# EAGLE design MegaShield (EAGLE 9.2.0)
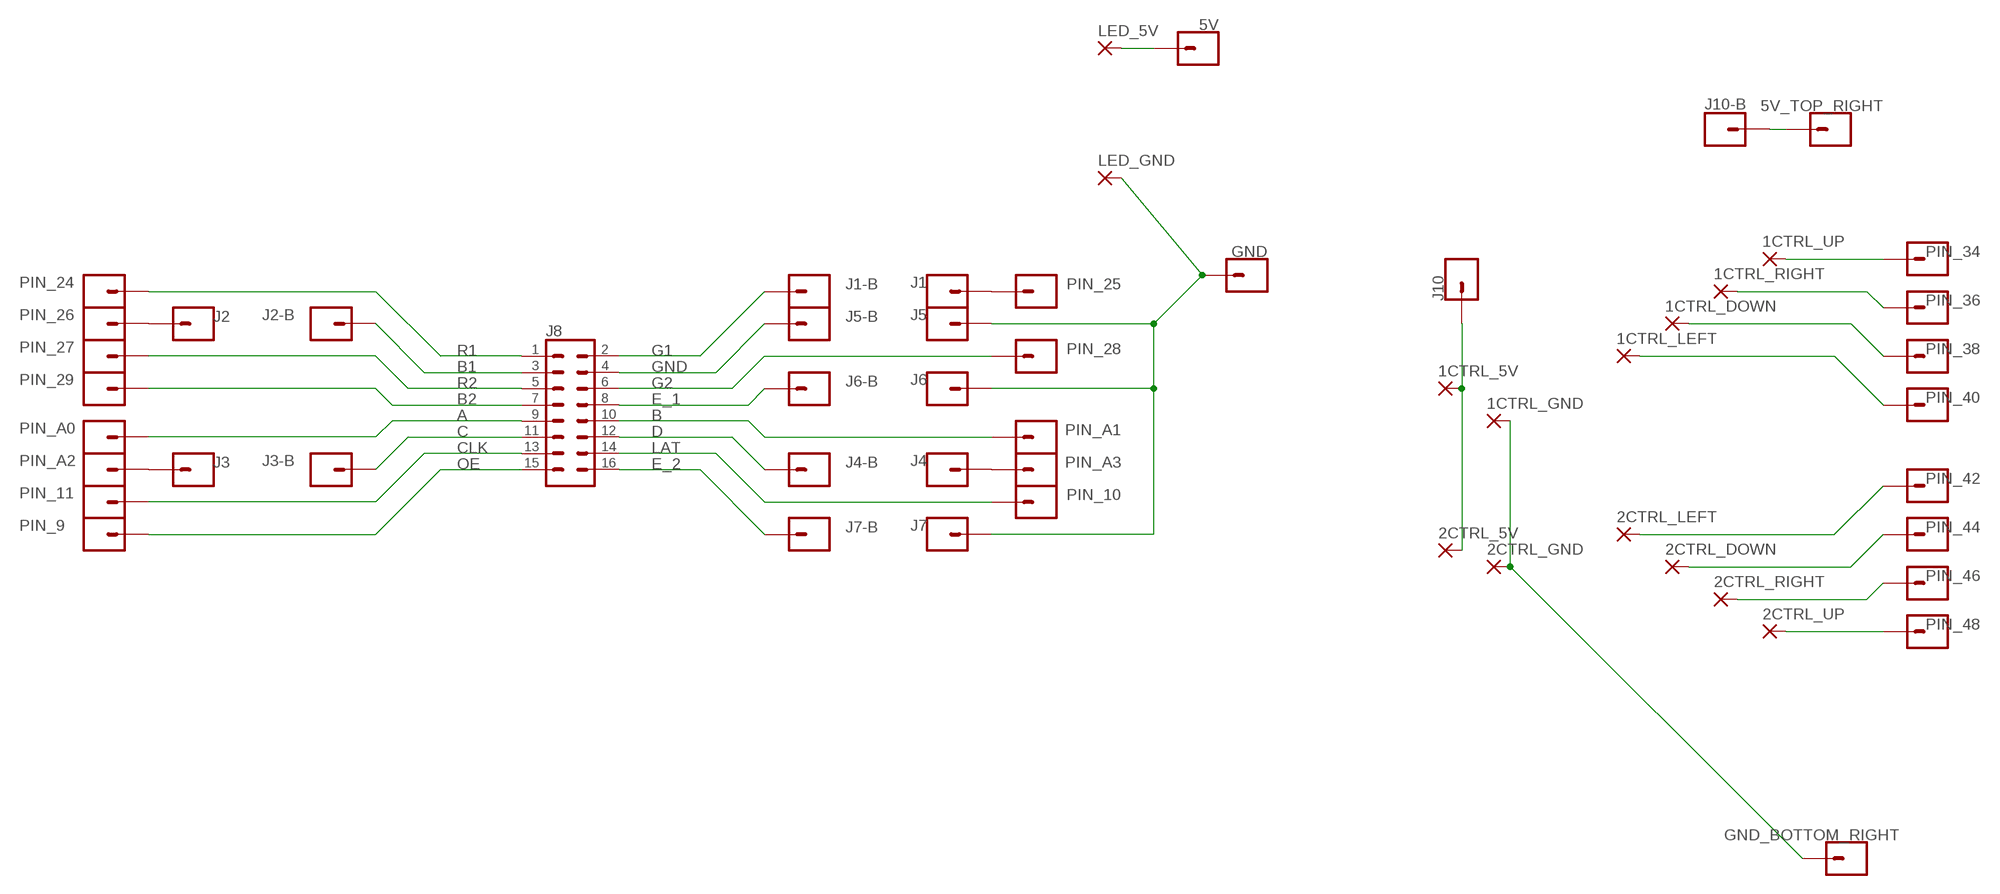
[diagram p0: schematic, sheet 1]

## Parts
1CTRL_5V  PADSMALL  [SMD2,54-5,08]
1CTRL_DOWN  PADSMALL  [SMD2,54-5,08]
1CTRL_GND  PADSMALL  [SMD2,54-5,08]
1CTRL_LEFT  PADSMALL  [SMD2,54-5,08]
1CTRL_RIGHT  PADSMALL  [SMD2,54-5,08]
1CTRL_UP  PADSMALL  [SMD2,54-5,08]
2CTRL_5V  PADSMALL  [SMD2,54-5,08]
2CTRL_DOWN  PADSMALL  [SMD2,54-5,08]
2CTRL_GND  PADSMALL  [SMD2,54-5,08]
2CTRL_LEFT  PADSMALL  [SMD2,54-5,08]
2CTRL_RIGHT  PADSMALL  [SMD2,54-5,08]
2CTRL_UP  PADSMALL  [SMD2,54-5,08]
5V  CONN_01  [1X01]
5V_TOP_RIGHT  CONN_01  [1X01]
GND  CONN_01  [1X01]
GND_BOTTOM_RIGHT  CONN_01  [1X01]
J1  CONN_01  [1X01]
J1-B  CONN_01  [1X01]
J2  CONN_01  [1X01]
J2-B  CONN_01  [1X01]
J3  CONN_01  [1X01]
J3-B  CONN_01  [1X01]
J4  CONN_01  [1X01]
J4-B  CONN_01  [1X01]
J5  CONN_01  [1X01]
J5-B  CONN_01  [1X01]
J6  CONN_01  [1X01]
J6-B  CONN_01  [1X01]
J7  CONN_01  [1X01]
J7-B  CONN_01  [1X01]
J8  CONN_08X2_SHROUD  [2X8-SHROUDED_LOCK]
J10  CONN_01  [1X01]
J10-B  CONN_01  [1X01]
LED_5V  PAD_EXLARGE  [SMD_EXLARGE]
LED_GND  PAD_EXLARGE  [SMD_EXLARGE]
PIN_9  CONN_01  [1X01]
PIN_10  CONN_01  [1X01]
PIN_11  CONN_01  [1X01]
PIN_24  CONN_01  [1X01]
PIN_25  CONN_01  [1X01]
PIN_26  CONN_01  [1X01]
PIN_27  CONN_01  [1X01]
PIN_28  CONN_01  [1X01]
PIN_29  CONN_01  [1X01]
PIN_34  CONN_01  [1X01]
PIN_36  CONN_01  [1X01]
PIN_38  CONN_01  [1X01]
PIN_40  CONN_01  [1X01]
PIN_42  CONN_01  [1X01]
PIN_44  CONN_01  [1X01]
PIN_46  CONN_01  [1X01]
PIN_48  CONN_01  [1X01]
PIN_A0  CONN_01  [1X01]
PIN_A1  CONN_01  [1X01]
PIN_A2  CONN_01  [1X01]
PIN_A3  CONN_01  [1X01]

## Nets
A: J8.9 PIN_A0.1
B: J8.10 PIN_A1.1
B1: J2-B.1 J8.3
B2: J8.7 PIN_29.1
C: J3-B.1 J8.11
CLK: J8.13 PIN_11.1
D: J4-B.1 J8.12
E_1: J6-B.1 J8.8
E_2: J7-B.1 J8.16
G1: J1-B.1 J8.2
G2: J8.6 PIN_28.1
GND: J5-B.1 J8.4
LAT: J8.14 PIN_10.1
N$1: J2.1 PIN_26.1
N$2: J3.1 PIN_A2.1
N$3: J1.1 PIN_25.1
N$4: 5V.1 LED_5V.P$1(P)
N$5: GND.1 J5.1 J6.1 J7.1 LED_GND.P$1(P)
N$6: J4.1 PIN_A3.1
N$7: 1CTRL_UP.1(P) PIN_34.1
N$8: 1CTRL_RIGHT.1(P) PIN_36.1
N$9: 1CTRL_DOWN.1(P) PIN_38.1
N$10: 1CTRL_LEFT.1(P) PIN_40.1
N$11: 2CTRL_UP.1(P) PIN_48.1
N$12: 2CTRL_RIGHT.1(P) PIN_46.1
N$13: 2CTRL_DOWN.1(P) PIN_44.1
N$14: 5V_TOP_RIGHT.1 J10-B.1
N$15: 1CTRL_5V.1(P) 2CTRL_5V.1(P) J10.1
N$16: 1CTRL_GND.1(P) 2CTRL_GND.1(P) GND_BOTTOM_RIGHT.1
N$17: 2CTRL_LEFT.1(P) PIN_42.1
OE: J8.15 PIN_9.1
R1: J8.1 PIN_24.1
R2: J8.5 PIN_27.1

## Library data of the parts
1CTRL_5V 1CTRL_DOWN 1CTRL_GND 1CTRL_LEFT 1CTRL_RIGHT 1CTRL_UP 2CTRL_5V 2CTRL_DOWN 2CTRL_GND 2CTRL_LEFT 2CTRL_RIGHT 2CTRL_UP = ENGR294:PADSMALL: SMD PAD
5V GND PIN_9-PIN_11 PIN_24-PIN_29 PIN_34 PIN_36 PIN_38 PIN_40 PIN_42 PIN_44 PIN_46 PIN_48 PIN_A0 PIN_A1-PIN_A3 = ENGR294:CONN_01: Single connection point. Often used as Generic Header-pin footprint for 0.1 inch spaced/style header connections On any of the 0.1 inch spaced packages, you can populate with these: Break Away Headers - Straight <https://www.sparkfun.com/products/116> (PRT-00116) Break Away Male Headers - Right Angle <https://www.sparkfun.com/products/553> (PRT-00553) Female Headers <https://www.sparkfun.com/products/115> (PRT-00115) Break Away Headers - Machine Pin <https://www.sparkfun.com/products/117> (PRT-00117) Break Away Female Headers - Swiss Machine Pin <https://www.sparkfun.com/products/743> (PRT-00743) This device is also useful as a general connection point to wire up your design to another part of your project. Our various solder wires solder well into these plated through hole pads. Hook-Up Wire - Assortment (Stranded, 22 AWG) <https://www.sparkfun.com/products/11375> (PRT-11375) Hook-Up Wire - Assortment (Solid Core, 22 AWG) <https://www.sparkfun.com/products/11367> (PRT-11367) View the entire wire category on our website here <https://www.sparkfun.com/categories/141> Special notes: SMTSO-256-ET is a "flush mount" nut for a 4-40 screw. We mostly use this on specialty testbeds; it is a nice way to connect hardware to your PCB at an adjustable hieght. Also note, the SNAP packages are for using a snappable style connector. We sell a baggie of snaps and they are also used on two LilyPad designs: Snap Assortment - 30 pack (male and female) <https://www.sparkfun.com/products/11347> (DEV-11347) LilyPad Arduino SimpleSnap <https://www.sparkfun.com/products/10941> (DEV-10941) LilyPad SimpleSnap Protoboard <https://www.sparkfun.com/products/10940> (DEV-10940)
5V_TOP_RIGHT GND_BOTTOM_RIGHT J1 J1-B J2 J2-B J3 J3-B J4 J4-B J5 J5-B J6 J6-B J7 J7-B J10 J10-B = SparkFun-Connectors:CONN_01: Single connection point. Often used as Generic Header-pin footprint for 0.1 inch spaced/style header connections On any of the 0.1 inch spaced packages, you can populate with these: Break Away Headers - Straight <https://www.sparkfun.com/products/116> (PRT-00116) Break Away Male Headers - Right Angle <https://www.sparkfun.com/products/553> (PRT-00553) Female Headers <https://www.sparkfun.com/products/115> (PRT-00115) Break Away Headers - Machine Pin <https://www.sparkfun.com/products/117> (PRT-00117) Break Away Female Headers - Swiss Machine Pin <https://www.sparkfun.com/products/743> (PRT-00743) This device is also useful as a general connection point to wire up your design to another part of your project. Our various solder wires solder well into these plated through hole pads. Hook-Up Wire - Assortment (Stranded, 22 AWG) <https://www.sparkfun.com/products/11375> (PRT-11375) Hook-Up Wire - Assortment (Solid Core, 22 AWG) <https://www.sparkfun.com/products/11367> (PRT-11367) View the entire wire category on our website here <https://www.sparkfun.com/categories/141> Special notes: SMTSO-256-ET is a "flush mount" nut for a 4-40 screw. We mostly use this on specialty testbeds; it is a nice way to connect hardware to your PCB at an adjustable hieght. Also note, the SNAP packages are for using a snappable style connector. We sell a baggie of snaps and they are also used on two LilyPad designs: Snap Assortment - 30 pack (male and female) <https://www.sparkfun.com/products/11347> (DEV-11347) LilyPad Arduino SimpleSnap <https://www.sparkfun.com/products/10941> (DEV-10941) LilyPad SimpleSnap Protoboard <https://www.sparkfun.com/products/10940> (DEV-10940)
J8 = ENGR294:CONN_08X2: Multi connection point. Often used as Generic Header-pin footprint for 0.1 inch spaced/style header connections You can populate with any combo of single row headers, but if you'd like an exact match, check this: Header - 2x8 (Male, 0.1") <https://www.sparkfun.com/products/13156> (PRT-13156) On any of the 0.1 inch spaced packages, you can populate with these: Break Away Headers - Straight <https://www.sparkfun.com/products/116> (PRT-00116) Break Away Male Headers - Right Angle <https://www.sparkfun.com/products/553> (PRT-00553) Female Headers <https://www.sparkfun.com/products/115> (PRT-00115) Break Away Headers - Machine Pin <https://www.sparkfun.com/products/117> (PRT-00117) Break Away Female Headers - Swiss Machine Pin <https://www.sparkfun.com/products/743> (PRT-00743)
LED_5V LED_GND = EdwardsCustom:PAD_EXLARGE: 0.3125" (fractional: 6/16") squared SMD pad

## Board
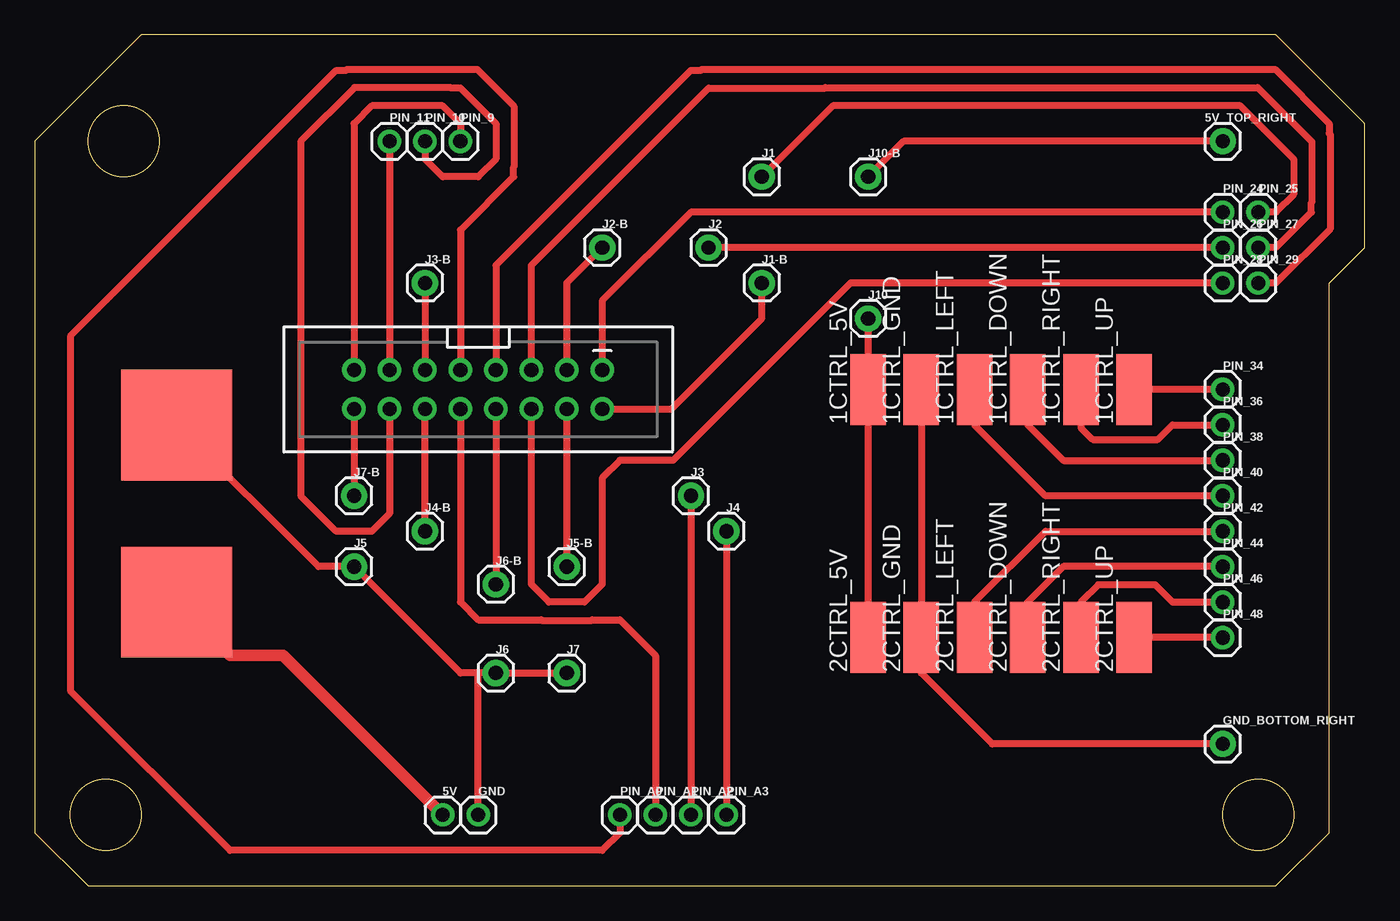
[diagram p1: board, top side]
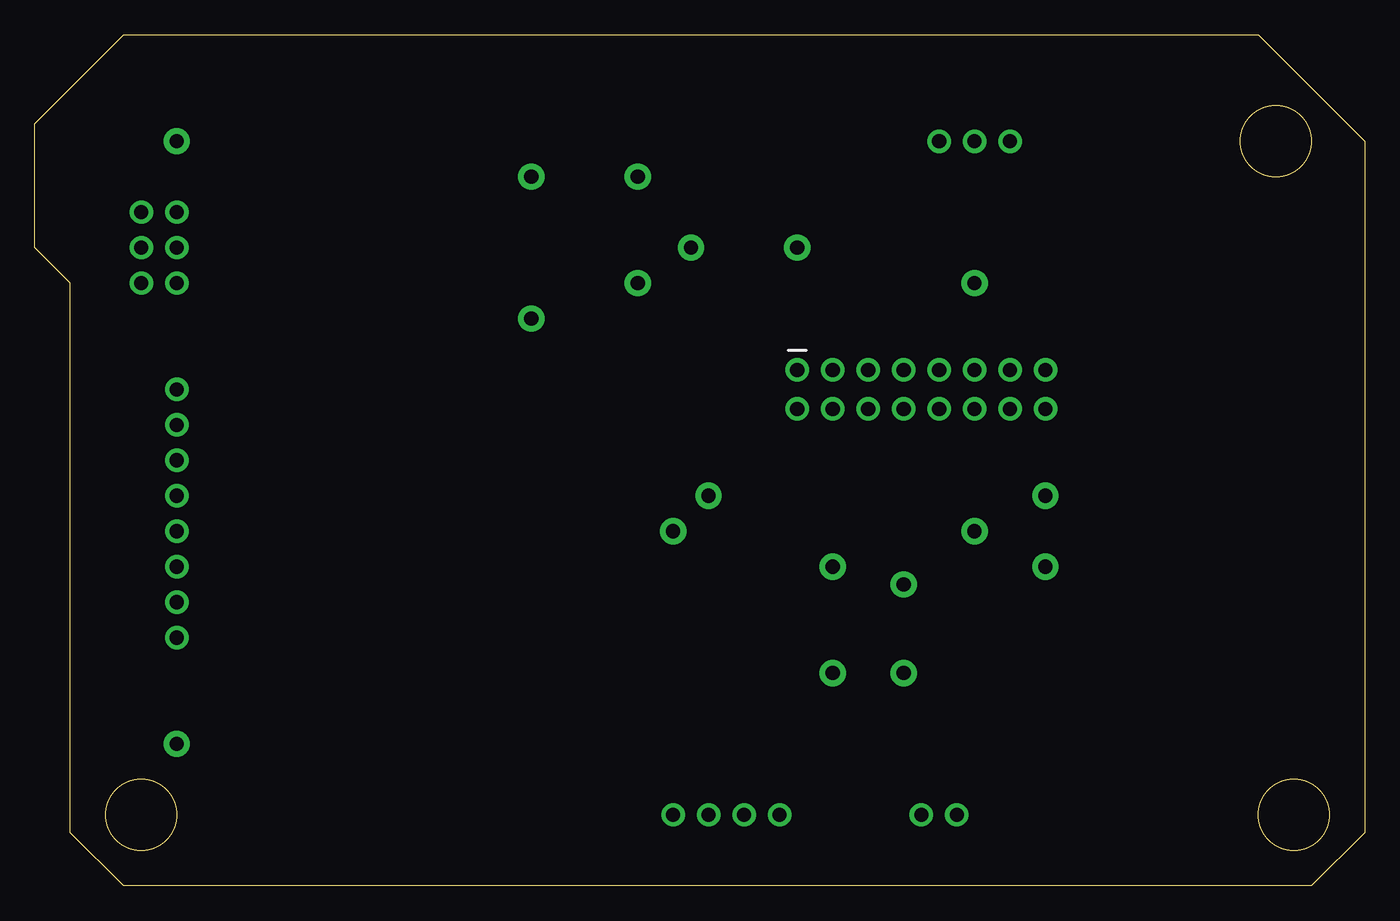
[diagram p2: board, bottom side, seen from below]

Size 95.25 x 60.96 mm. Coordinates in mm from the lower left corner, seen from the top.
Outline: 0,53.34 0,3.81 3.81,0 88.9,0 92.71,3.81 92.71,43.18 95.25,45.72 95.25,54.61 88.9,60.96 7.62,60.96 0,53.34
Outline: circle at 5.08,5.08 radius 2.54
Outline: circle at 6.35,53.34 radius 2.54
Outline: circle at 87.63,5.08 radius 2.54
Copper layers (1*16): Top 0.035mm / dielectric 1.5mm / Bottom 0.035mm
Design rules "OthermillDRC_1_32_v2": minimum track width 8mil, minimum drill 0.8mm, track to track 0.794003125mm, track to pad 0.794003125mm, pad to pad 0.794003125mm, via to via 0.794003125mm, smd to smd 0mil, copper to edge 0mil, drill to drill 1mil, minimum pad ring 10mil, minimum via ring 10mil, stop-mask expansion 1mil, vias tented up to drill 30mil, thermal gap 10mil

### Footprints (pad centres in the part's own frame; a part is rotated, then mirrored left to right if it is on the bottom)
SMD2,54-5,08 = smd 2.54 x 5.08: 1 0,0
1X01 = drill 1.016 pad 1.676: 1 0,0
1X01' = drill 1.016 pad 1.88: 1 0,0
2X8-SHROUDED_LOCK = drill 1.016 pad 1.676: 1 -1.397,8.89; 2 1.397,8.89; 3 -1.397,6.35; 4 1.397,6.35; 5 -1.397,3.81; 6 1.397,3.81; 7 -1.397,1.27; 8 1.397,1.27; 9 -1.397,-1.27; 10 1.397,-1.27; 11 -1.397,-3.81; 12 1.397,-3.81; 13 -1.397,-6.35; 14 1.397,-6.35; 15 -1.397,-8.89; 16 1.397,-8.89
SMD_EXLARGE = smd 7.938 x 7.938: P$1 0,0

### Placement (x,y rotation side)
1CTRL_5V  59.69,35.56 0 top
1CTRL_DOWN  71.12,35.56 0 top
1CTRL_GND  63.5,35.56 0 top
1CTRL_LEFT  67.31,35.56 0 top
1CTRL_RIGHT  74.93,35.56 0 top
1CTRL_UP  78.74,35.56 0 top
2CTRL_5V  59.69,17.78 0 top
2CTRL_DOWN  71.12,17.78 0 top
2CTRL_GND  63.5,17.78 0 top
2CTRL_LEFT  67.31,17.78 0 top
2CTRL_RIGHT  74.93,17.78 0 top
2CTRL_UP  78.74,17.78 0 top
5V  29.21,5.08 0 top
5V_TOP_RIGHT  [1X01']  85.09,53.34 0 top
GND  31.75,5.08 0 top
GND_BOTTOM_RIGHT  [1X01']  85.09,10.16 0 top
J1  [1X01']  52.07,50.8 0 top
J1-B  [1X01']  52.07,43.18 0 top
J2  [1X01']  48.26,45.72 0 top
J2-B  [1X01']  40.64,45.72 0 top
J3  [1X01']  46.99,27.94 0 top
J3-B  [1X01']  27.94,43.18 0 top
J4  [1X01']  49.53,25.4 0 top
J4-B  [1X01']  27.94,25.4 0 top
J5  [1X01']  22.86,22.86 0 top
J5-B  [1X01']  38.1,22.86 0 top
J6  [1X01']  33.02,15.24 0 top
J6-B  [1X01']  33.02,21.59 0 top
J7  [1X01']  38.1,15.24 0 top
J7-B  [1X01']  22.86,27.94 0 top
J8  31.75,35.56 270 top
J10  [1X01']  59.69,40.64 0 top
J10-B  [1X01']  59.69,50.8 0 top
LED_5V  10.16,20.32 0 top
LED_GND  10.16,33.02 0 top
PIN_9  30.48,53.34 0 top
PIN_10  27.94,53.34 0 top
PIN_11  25.4,53.34 0 top
PIN_24  85.09,48.26 0 top
PIN_25  87.63,48.26 0 top
PIN_26  85.09,45.72 0 top
PIN_27  87.63,45.72 0 top
PIN_28  85.09,43.18 0 top
PIN_29  87.63,43.18 0 top
PIN_34  85.09,35.56 0 top
PIN_36  85.09,33.02 0 top
PIN_38  85.09,30.48 0 top
PIN_40  85.09,27.94 0 top
PIN_42  85.09,25.4 0 top
PIN_44  85.09,22.86 0 top
PIN_46  85.09,20.32 0 top
PIN_48  85.09,17.78 0 top
PIN_A0  41.91,5.08 0 top
PIN_A1  44.45,5.08 0 top
PIN_A2  46.99,5.08 0 top
PIN_A3  49.53,5.08 0 top

### Tracks (layer width: path | path; a pad name or v marks a point on that pad's centre or on a via)
A
  Top 0.508: PIN_A0.1 41.91,3.81 40.64,2.54 13.97,2.54 2.54,13.97 2.54,39.37 21.59,58.42 22.29,58.42 22.35,58.48 31.69,58.48 34.32,55.85 34.32,51.53 34.29,51.5 34.29,50.8 30.48,46.99 J8.9
B
  Top 0.508: PIN_A1.1 44.45,16.51 41.91,19.05 39.94,19.05 39.91,19.02 36.29,19.02 36.26,19.05 31.75,19.05 30.48,20.32 J8.10
B1
  Top 0.508: J2-B.1 38.1,43.18 J8.3
B2
  Top 0.508: PIN_29.1 88.9,43.18 92.77,47.05 92.77,53.85 92.71,53.91 92.71,54.61 88.84,58.48 47.75,58.48 47.69,58.42 46.99,58.42 33.02,44.45 J8.7
C
  Top 0.508: J3-B.1 J8.11
CLK
  Top 0.508: PIN_11.1 J8.13
D
  Top 0.508: J4-B.1 J8.12
E_1
  Top 0.508: J8.8 J6-B.1
E_2
  Top 0.508: J8.16 J7-B.1
G1
  Top 0.508: J1-B.1 52.07,40.64 45.59,34.16 J8.2
G2
  Top 0.508: PIN_28.1 58.42,43.18 45.72,30.48 41.91,30.48 40.64,29.21 40.64,21.59 39.37,20.32 36.83,20.32 35.56,21.59 J8.6
GND
  Top 0.508: J8.4 J5-B.1
LAT
  Top 0.508: PIN_10.1 27.94,52.07 29.21,50.8 31.75,50.8 33.02,52.07 33.02,54.61 30.48,57.15 29.78,57.15 29.75,57.18 22.89,57.18 19.05,53.34 19.05,27.94 21.59,25.4 24.13,25.4 25.4,26.67 J8.14
N$1
  Top 0.508: PIN_26.1 J2.1
N$2
  Top 0.508: J3.1 PIN_A2.1
N$3
  Top 0.508: J1.1 57.15,55.88 86.36,55.88 90.17,52.07 90.17,49.53 88.9,48.26 PIN_25.1
N$4
  Top 0.508: LED_5V.P$1 12.06,18.41
  Top 0.813: 12.06,18.41 13.97,16.51 17.78,16.51 5V.1
N$5
  Top 0.508: 31.75,15.24 J6.1 J7.1 | 31.75,15.24 30.48,15.24 J5.1 20.32,22.86 LED_GND.P$1 | GND.1 31.75,15.24
N$6
  Top 0.508: J4.1 PIN_A3.1
N$7
  Top 0.508: PIN_34.1 1CTRL_UP.1
N$8
  Top 0.508: 1CTRL_RIGHT.1 74.93,32.81 75.77,31.97 80.44,31.97 81.49,33.02 PIN_36.1
N$9
  Top 0.508: 1CTRL_DOWN.1 71.12,33.02 73.66,30.48 PIN_38.1
N$10
  Top 0.508: 1CTRL_LEFT.1 67.31,33.02 72.39,27.94 PIN_40.1
N$11
  Top 0.508: PIN_48.1 2CTRL_UP.1
N$12
  Top 0.508: 2CTRL_RIGHT.1 74.93,20.32 76.17,21.56 80.25,21.56 81.49,20.32 PIN_46.1
N$13
  Top 0.508: 2CTRL_DOWN.1 71.12,20.32 73.66,22.86 PIN_44.1
N$14
  Top 0.508: 5V_TOP_RIGHT.1 62.23,53.34 J10-B.1
N$15
  Top 0.508: 2CTRL_5V.1 1CTRL_5V.1 J10.1
N$16
  Top 0.508: GND_BOTTOM_RIGHT.1 68.58,10.16 63.5,15.24 2CTRL_GND.1 1CTRL_GND.1
N$17
  Top 0.508: 2CTRL_LEFT.1 67.31,20.32 72.39,25.4 PIN_42.1
OE
  Top 0.508: PIN_9.1 30.48,54.61 29.21,55.88 24.13,55.88 22.86,54.61 J8.15
R1
  Top 0.508: PIN_24.1 46.99,48.26 40.64,41.91 J8.1
R2
  Top 0.508: PIN_27.1 88.9,45.72 91.44,48.26 91.44,48.96 91.47,48.99 91.47,53.31 87.6,57.18 56.61,57.18 56.58,57.15 48.26,57.15 35.56,44.45 J8.5